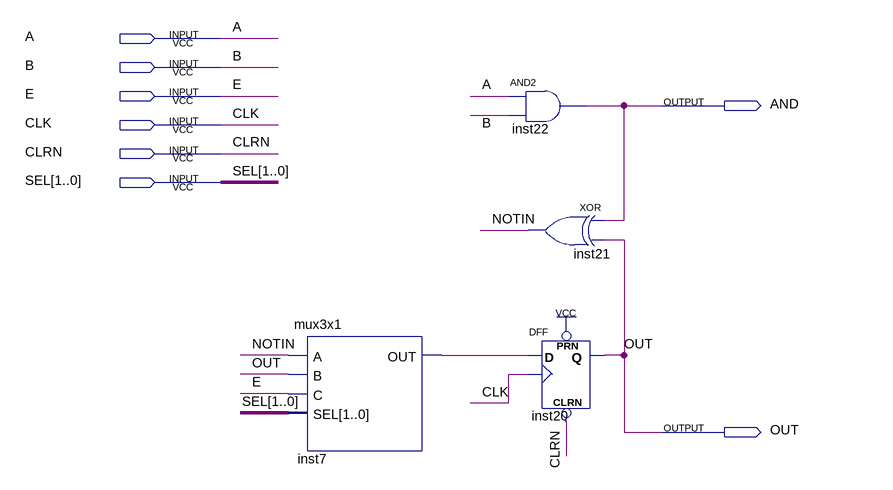
[diagram p0: schematic sheet]
// Quartus schematic bitcounter.bdf as structural Verilog: 4 symbols, 8 pins
module bitcounter (
  input  A,
  input  B,
  input  E,
  input  CLK,
  input  CLRN,
  input  [1:0] SEL,
  output AND,
  output OUT
);

  wire inst7_out, NOTIN;

  mux3x1 inst7 (.A(NOTIN), .B(OUT), .C(E), .SEL(SEL), .OUT(inst7_out));
  and inst22 (AND, A, B);
  xor inst21 (NOTIN, AND, OUT);
  DFF inst20 (.CLRN(CLRN), .CLK(CLK), .D(inst7_out), .PRN(1'b1), .Q(OUT));
endmodule
